# EasyEDA Pro project 包裹款-触摸屏控制板V1.eprj, schematic 原理图
Board Name: ESP32s3; Create Date: 2025-05-14; Page Name: 电源; Project Name: 包裹款-触摸屏控制板V1.0; Schematic Name: 原理图; Update Date: 2026-03-25; Company: 嘉立创EDA; Page Size: A3; Version: V1.0
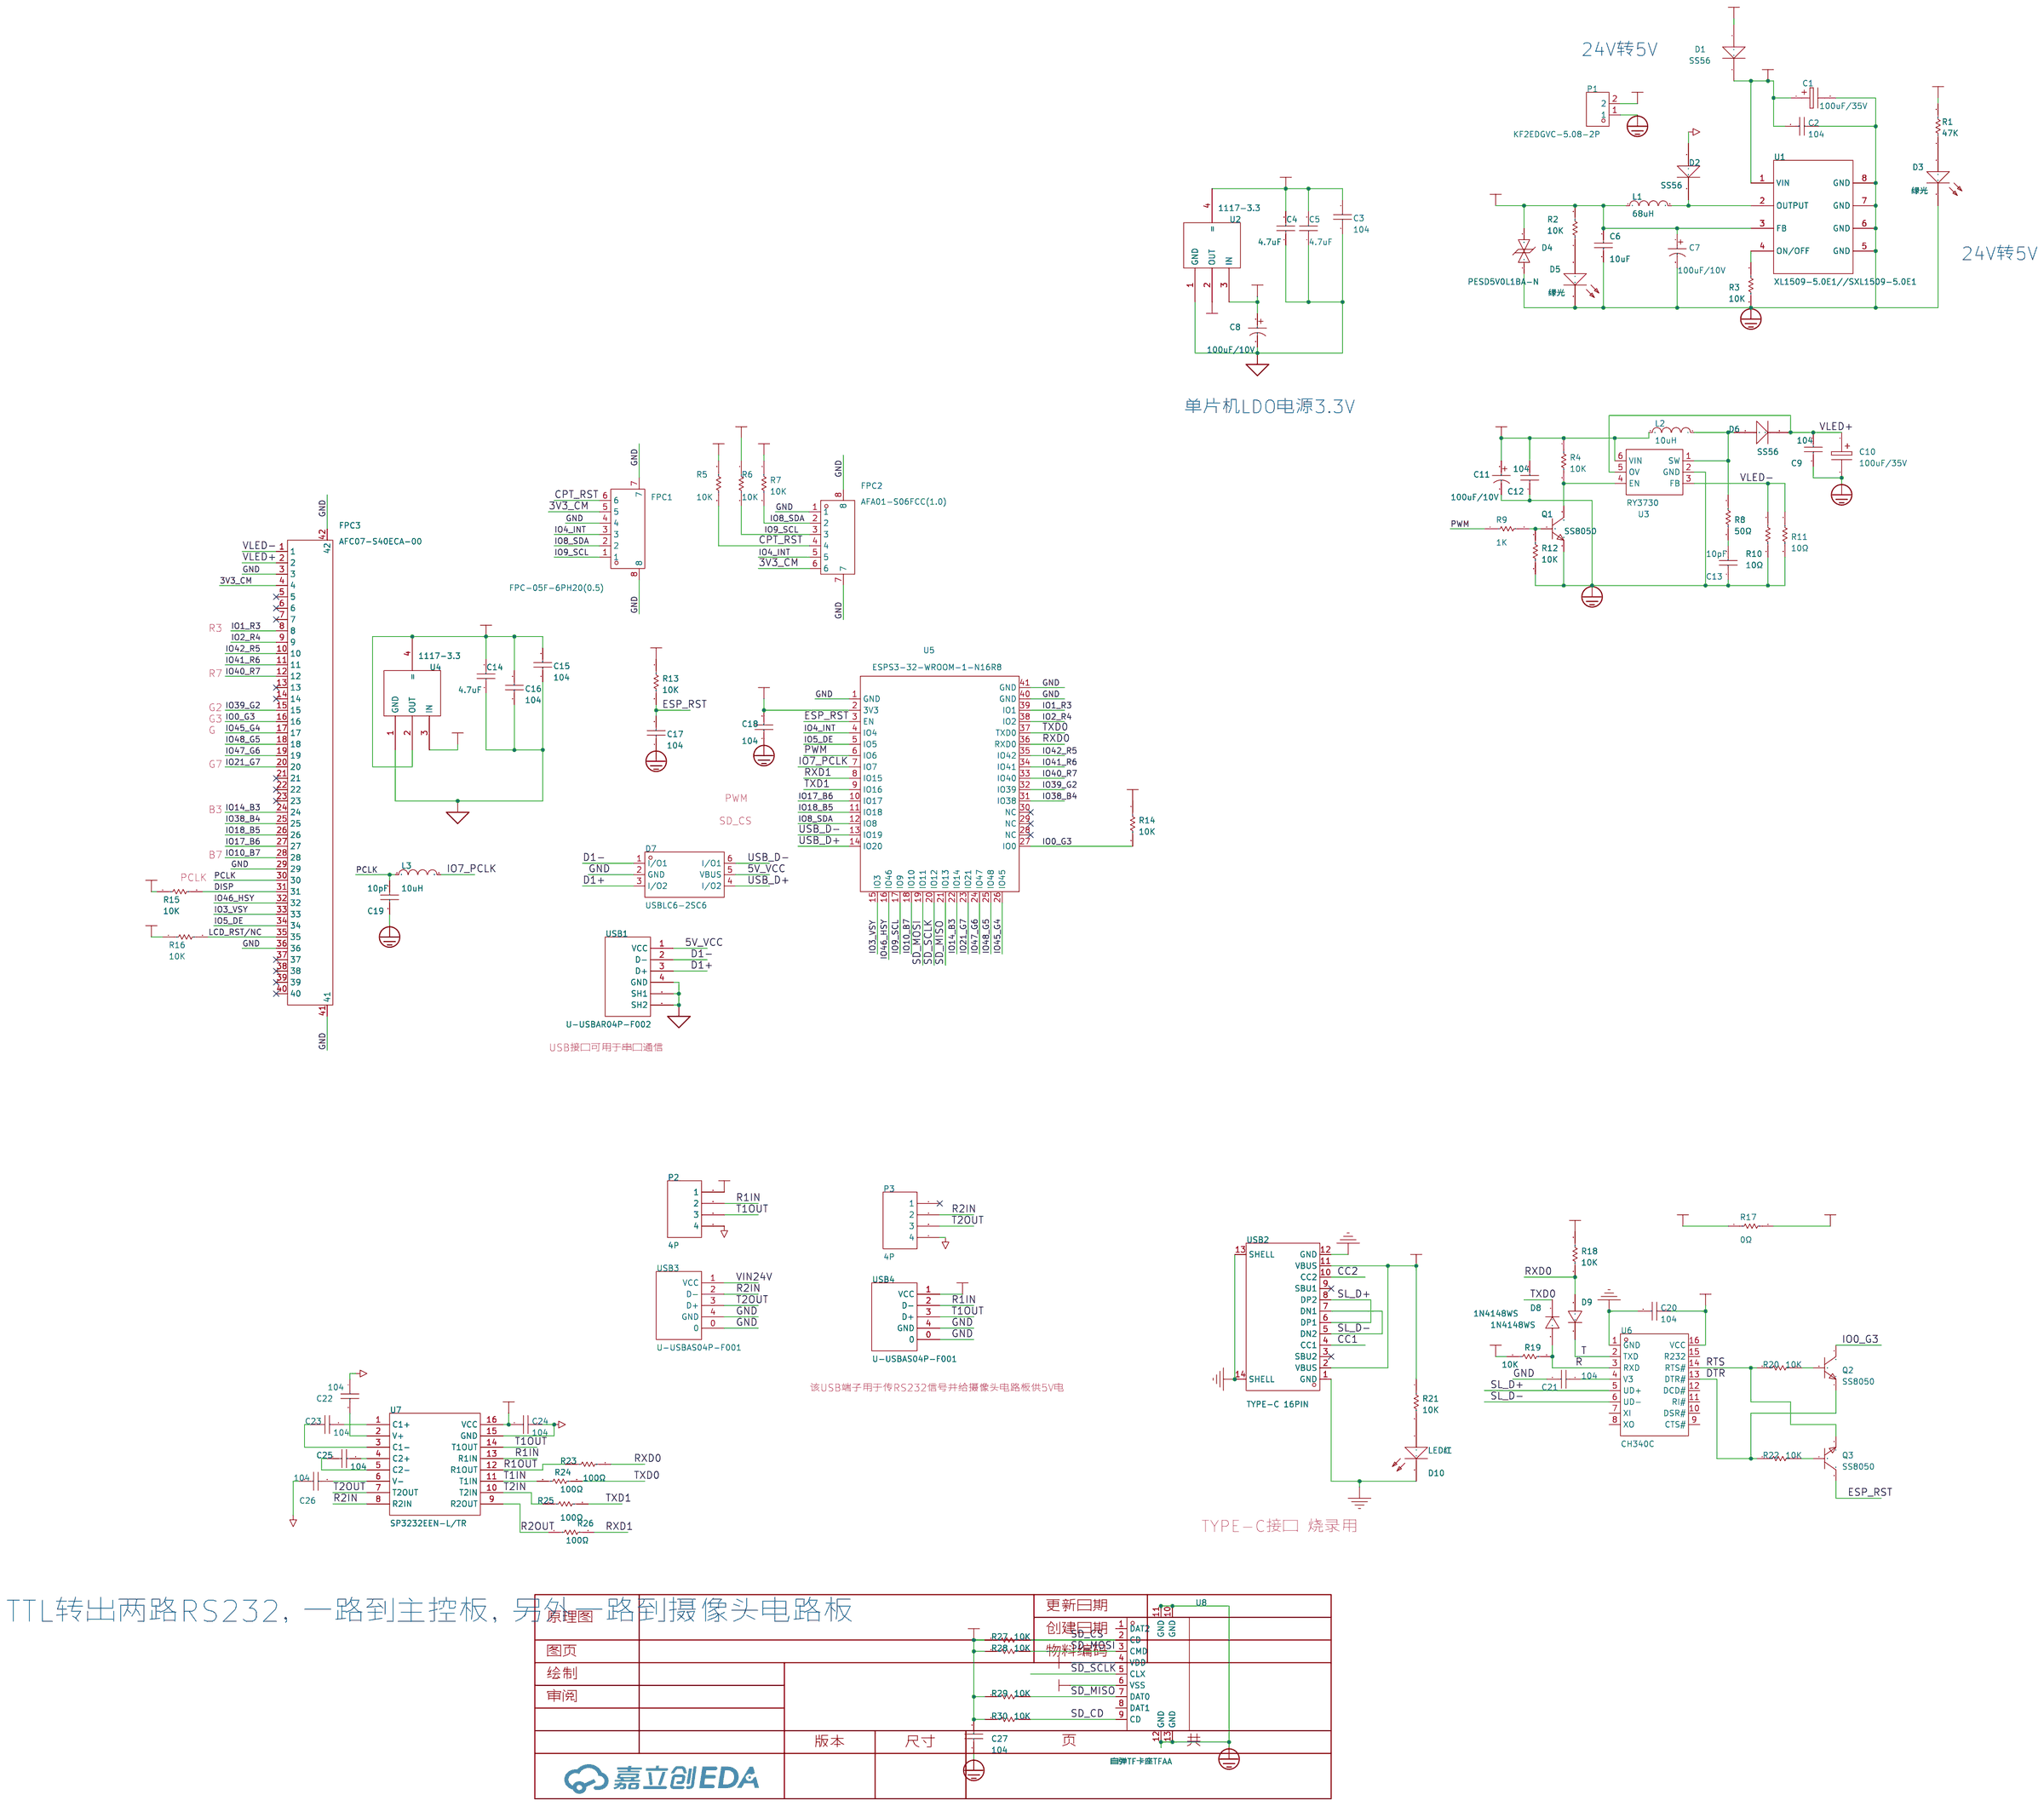
[diagram p0: schematic sheet]

## Parts
C1  100uF/35V  [电解电容贴片6X6]
C2  104  [0603C]
C3  104  [0603C]
C4  4.7uF  [C1206]
C5  4.7uF  [C1206]
C6  10uF  [C1206]
C7  100uF/10V  [CAP-SMD_BD5.0-L5.3-W5.3-RD]
C8  100uF/10V  [CAP-SMD_BD5.0-L5.3-W5.3-RD]
C9  104  [0603C]
C10  100uF/35V  [电解电容贴片6X6]
C11  100uF/10V  [CAP-SMD_BD5.0-L5.3-W5.3-RD]
C12  104  [0603C]
C13  10pF  [0603C]
C14  4.7uF  [C1206]
C15  104  [0603C]
C16  104  [0603C]
C17  104  [0603C]
C18  104  [0603C]
C19  10pF  [0603C]
C20  104  [0603C]
C21  104  [0603C]
C22  104  [0603C]
C23  104  [0603C]
C24  104  [0603C]
C25  104  [0603C]
C26  104  [0603C]
C27  104  [0603C]
D1  SS56  [SMA]
D2  SS56  [SMA]
D3  绿光  [0603LED]
D4  PESD5V0L1BA-N  [SOD-323_L1.8-W1.3-LS2.5-BI]
D5  绿光  [0603LED]
D6  SS56  [SMA]
D7  USBLC6-2SC6  [SOT-23-6_L2.9-W1.6-P0.95-LS2.8-BL]
D8  1N4148WS  [SOD-323_L1.8-W1.3-LS2.5-RD]
D9  1N4148WS  [SOD-323_L1.8-W1.3-LS2.5-RD]
D10  LED红  [0603L]
FPC1  FPC-05F-6PH20(0.5)  [FPC-SMD_6P-P0.50_XUNPU_FPC-05F-6PH20]
FPC2  AFA01-S06FCC(1.0)  [FPC-SMD_6P-P1.00_AFA01-S06]
FPC3  AFC07-S40ECA-00  [FPC-SMD_P0.50-40P_LCS-SJ-H2.0]
L1  68uH  [IND-SMD_L7.0-W7.0_SMDRI74-330MT]
L2  10uH  [IND-SMD_L7.0-W7.0_SMDRI74-330MT]
L3  10uH  [L0603]
P1  KF2EDGVC-5.08-2P  [CONN-TH_P5.08_KF2EDGVC-5.08-2P]
P2  4P  [HDR1X4_CON]
P3  4P  [HDR1X4_CON]
Q1  SS8050  [SOT-23-3_L2.9-W1.3-P1.90-LS2.4-BR]
Q2  SS8050  [SOT-23-3_L2.9-W1.3-P1.90-LS2.4-BR]
Q3  SS8050  [SOT-23-3_L2.9-W1.3-P1.90-LS2.4-BR]
R1  47K  [0603R]
R2  10K  [0603R]
R3  10K  [0603R]
R4  10K  [10]
R5  10K  [0603R]
R6  10K  [0603R]
R7  10K  [0603R]
R8  10K  [0603R]
R9  1K  [10]
R10  10K  [0603R]
R11  10K  [0603R]
R12  10K  [10]
R13  10K  [0603R]
R14  10K  [0603R]
R15  10K  [0603R]
R16  10K  [0603R]
R17  0Ω  [10]
R18  10K  [0603R]
R19  10K  [0603R]
R20  10K  [10]
R21  10K  [10]
R22  10K  [10]
R23  100Ω  [0603R]
R24  100Ω  [0603R]
R25  100Ω  [0603R]
R26  100Ω  [0603R]
R27  10K  [10]
R28  10K  [10]
R29  10K  [10]
R30  10K  [10]
U1  XL1509-5.0E1//SXL1509-5.0E1  [ESOP-8_L4.9-W3.9-P1.27-LS6.0-BL-EP]
U2  1117-3.3  [SOT-223]
U3  RY3730  [SOT-23-6_L2.9-W1.6-P0.95-LS2.8-BL_3]
U4  1117-3.3  [SOT-223]
U5  ESPS3-32-WROOM-1-N16R8  [WIRELM-SMD_ESP32-S3-WROOM-2-N32R8V]
U6  CH340C  [SOIC-16_L9.9-W3.9-P1.27-LS6.0-BL]
U7  SP3232EEN-L/TR  [SOIC-16_L9.9-W3.9-P1.27-LS6.0-BL]
U8  自弹TF卡座TFAA  [SIM-SMD_C9900015645]
USB1  U-USBAR04P-F002  [USB-A-TH_USB-302-T]
USB2  TYPE-C 16PIN  [USB-C-SMD_TYPE-C-6PIN+]
USB3  U-USBAS04P-F001  [USB-A-TH_USB-M-22]
USB4  U-USBAS04P-F001  [USB-A-TH_USB-M-22]

## Library data of the parts
C1 C10 = 100uF/35V: Origin Footprint 2: X47U; Origin Footprint 1: 电解电容贴片6x6; Design Item ID: ELECTRO1; Library Name: *
C2 C3 C9 C12 C13 C15-C19 C27 = 104: Capacitor (Semiconductor SIM Model); Published: 8-Jun-2000; LatestRevisionDate: 17-Jul-2002; LatestRevisionNote: Re-released for DXP Platform.; PackageReference: C1206; Publisher: Altium Limited; Origin Footprint 2: C1206; Origin Footprint 3: 0402; Origin Footprint 4: 1310[0504]; Origin Footprint 5: 1608[0603]; Origin Footprint 6: C1210; Origin Footprint 7: C0805; Origin Footprint 8: C1206; Origin Footprint 9: 0805; Origin Footprint 10: 0805L; Design Item ID: Cap Semi; Library Name: Miscellaneous Devices
C4-C6 C14 = 104: Design Item ID: CAP; Library Name: SCH--װ--
C7 C8 C11 = CS1A101M-CRD54: 容值:100uF;精度:±20%;额定电压:10V;电容体直径:5mm;电容体长度:5.4mm;纹波电流:-;等效串联电阻:-;工作寿命:1000hrs@105℃;工作温度:-40℃~+105℃;; LCSC Part Name: 100uF ±20% 10V; Supplier Part: C96182; Manufacturer: ST(先科); Supplier Footprint: SMD,5x5.4mm; JLCPCB Part Class: Extended Part; Datasheet: https://atta.szlcsc.com/upload/public/pdf/source/20170304/1488621207726.pdf; Supplier: LCSC; Tolerance: ±20%; Rated Voltage: 10V; φD: 5mm; L: 5.4mm; Lifetime @ Temp: 1000hrs@105℃; Operating Temperature: -40℃~+105℃
C20 C22-C26 = 103: Capacitor (Semiconductor SIM Model); Published: 8-Jun-2000; LatestRevisionDate: 17-Jul-2002; LatestRevisionNote: Re-released for DXP Platform.; PackageReference: C1206; Publisher: Altium Limited; Origin Footprint 2: C1206; Origin Footprint 3: 0402; Origin Footprint 4: 1310[0504]; Origin Footprint 5: 1608[0603]; Origin Footprint 6: C1210; Origin Footprint 7: C0805; Origin Footprint 8: C1206; Origin Footprint 9: 0805; Origin Footprint 10: 0805L; Design Item ID: Cap Semi; Library Name: Miscellaneous Devices
C21 = 104: Capacitor (Semiconductor SIM Model); Published: 8-Jun-2000; LatestRevisionDate: 17-Jul-2002; LatestRevisionNote: Re-released for DXP Platform.; PackageReference: C1206; Publisher: Altium Limited; Origin Footprint 2: C1206; Origin Footprint 3: 0402; Origin Footprint 4: 1310[0504]; Origin Footprint 5: 1608[0603]; Origin Footprint 6: C1210; Origin Footprint 7: C0805; Origin Footprint 8: C1206; Origin Footprint 9: 0805; Origin Footprint 10: 0805L; Origin Footprint 11: 0805C; Design Item ID: Cap Semi; Library Name: Miscellaneous Devices
D1 = SS56: Design Item ID: 1N4148; Library Name: SCH封装库
D2 D6 = SS56: Design Item ID: 1N4148; Library Name: SCH--װ--
D3 D5 = 绿光: Origin Footprint 2: LED(小); Design Item ID: LED; Library Name: SCH封装库
D4 = PESD5V0S1BBN: 极性:Bidirectional;反向关断电压（典型值）:5V (Max);击穿电压（最小值）:6V;箝位电压:15V;峰值脉冲电流（10/1000us）:5A (8/20us);; Supplier Part: C314264; Manufacturer: BORN伯恩半导体; Supplier Footprint: SOD-523; JLCPCB Part Class: Extended Part; Datasheet: https://atta.szlcsc.com/upload/public/pdf/source/20181015/C314264_F9AC5761AC2631DA841FBD1D9C6821E3.pdf; Supplier: LCSC; Polarity: Bidirectional; Voltage - Reverse Standoff (Typ): 5V (Max); Voltage - Breakdown (Min): 6V; Voltage - Clamping (Max) @ Ipp: 15V; Current - Peak Pulse (10/1000μs): 5A (8/20us)
D7 = USBLC6-2SC6: 最大钳位电压:15V;击穿电压:6V;; Supplier Part: C2687116; Manufacturer: UMW(友台半导体); Supplier Footprint: SOT-23-6; JLCPCB Part Class: 扩展库; Datasheet: https://atta.szlcsc.com/upload/public/pdf/source/20231109/512642D850D9873E7C519F71E85B9A10.pdf; Supplier: LCSC; Maximum Clamping Voltage: 15V; Breakdown Voltage: 6V; Number of Lines: 双路; Type: ESD
D8 D9 = 1N4148WS_C2128: 二极管配置:独立式;正向压降(Vf):1.25V@150mA;直流反向耐压(Vr):100V;整流电流:150mA;反向恢复时间(Trr):4ns;; LCSC Part Name: 丝印T4 1N4148WS; Supplier Part: C2128; Manufacturer: CJ(江苏长电/长晶); Supplier Footprint: SOD-323; JLCPCB Part Class: 基础库; Datasheet: https://item.szlcsc.com/datasheet/1N4148WS/2485.html; Supplier: LCSC; Diode Configuration: 独立式; Voltage - Forward(Vf@If): 1.25V@150mA; Voltage - DC Reverse(Vr): 100V; Current - Rectified: 150mA; Pd - Power Dissipation: 200mW; Reverse Leakage Current (Ir): 1uA@75V; Reverse Recovery Time (trr): 4ns; Non-Repetitive Peak Forward Surge Current: 2A
D10 = LED3: Typical BLUE SiC LED; Published: 8-Jun-2000; LatestRevisionDate: 17-Dec-2003; LatestRevisionNote: PCB Footprint replaced.; DatasheetVersion: 16-Apr-2002; PackageVersion: 16-Apr-2002; PackageReference: 3.5X2.8X1.9; Publisher: Altium Limited; PackageDescription: SM LED; 2 C-Bend Leads; Body 3.5 x 2.8 x 1.9 mm, inc leads (LxWxH typ); Origin Footprint 2: 3.5X2.8X1.9; Library Name: Miscellaneous Devices; Check: true
FPC1 = FPC-05F-6PH20: LCSC Part Name: 翻盖式 卧贴 P数:6P 间距:0.5mm; Supplier Part: C2856796; Manufacturer: XUNPU(讯普); Supplier Footprint: SMD,P=0.5mm,卧贴; JLCPCB Part Class: 扩展库; Datasheet: https://item.szlcsc.com/datasheet/FPC-05F-6PH20/3056894.html; Supplier: LCSC; Locking Feature: 翻盖式; Contact Type: 卧贴; Number of Contacts: 6P; Pitch: 0.5mm; Mounting Type: 下接; FFC, FCB Thickness: 0.3mm; Height Above Board: 2mm; Contact Material: 磷青铜; Contact Plating: 锡; Operating Temperature: -25℃~+85℃; Rated Voltage (Max): 50V; Current Rating (Max): 500mA
FPC2 = AFA01-S06FCC-00: LCSC Part Name: 翻盖式 下接 P数:6P 间距:1mm; Supplier Part: C262383; Manufacturer: JS(钜硕电子); Supplier Footprint: SMD,P=1mm,卧贴; JLCPCB Part Class: 扩展库; Datasheet: https://item.szlcsc.com/datasheet/AFA01-S06FCC-00/253767.html; Supplier: LCSC; Locking Feature: 翻盖式; Contact Type: 下接; Number of Contacts: 6P; Pitch: 1mm; Mounting Type: 卧贴; FFC, FCB Thickness: 0.3mm; Height Above Board: 2mm; Contact Material: 磷青铜; Operating Temperature: -45℃~+85℃; Rated Voltage (Max): 50V; Current Rating (Max): 500mA
FPC3 = AFC07-S40ECA-00: LCSC Part Name: 间距:0.5mm P数:40P 抽屉式 上接; Supplier Part: C262648; Manufacturer: JS(钜硕电子); Supplier Footprint: SMD,P=0.5mm,卧贴; JLCPCB Part Class: 扩展库; Datasheet: https://item.szlcsc.com/datasheet/AFC07-S40ECA-00/253907.html; Supplier: LCSC; Locking Feature: 抽屉式; Contact Type: 上接; Number of Contacts: 40P; Pitch: 0.5mm; Mounting Type: 卧贴; FFC, FCB Thickness: 0.3mm; Height Above Board: 2mm
L1 L2 = SMDRI74-330MT: 电感值:33uH;精度:±20%;额定电流:960mA;饱和电流(Isat):1.8A;类型:屏蔽电感;; LCSC Part Name: 33uH±20%1.8A; Supplier Part: C49625; Manufacturer: SXN(顺翔诺); Supplier Footprint: SMD,7.5x7.5mm; JLCPCB Part Class: 扩展库; Datasheet: https://atta.szlcsc.com/upload/public/pdf/source/20210810/6F96FDC19AA308DD2AD166FFB9640E87.pdf; Supplier: LCSC; Tolerance: ±20%; Rated Current: 960mA; Saturation Current (Isat): 1.8A; DC Resistance (DCR): 170mΩ; Type: 屏蔽电感
L3 = SDFL1608S100KTF: LCSC Part Name: 10uH ±10%; Supplier Part: C1035; Manufacturer: Sunlord(顺络); Supplier Footprint: 0603; JLCPCB Part Class: 基础库; Datasheet: https://item.szlcsc.com/datasheet/SDFL1608S100KTF/1387.html; Supplier: LCSC; Tolerance: ±10%; Current Rating: 3mA; DC Resistance(DCR): 1.85Ω; Q @ Frequency: 30@2MHz; Frequency - Self Resonant: 17MHz
P1 = KF2EDGVC-5.08-2P: LCSC Part Name: 5.08mm 1x2P 排数:1 每排P数:2; Supplier Part: C441386; Manufacturer: KEFA(科发); Supplier Footprint: 插件,P=5.08mm; JLCPCB Part Class: 扩展库; Datasheet: https://item.szlcsc.com/datasheet/KF2EDGVC-5.08-2P/441359.html; Supplier: LCSC; Connector Type: 板端/插座-闭口; Number of Positions or Pins: 1x2P; Pitch: 5.08mm; Color: 绿色; Mounting Type: 直针; Number of Pins: 2P; Number of Rows: 1; Number of PINs Per Row: 2; Current Rating: 15A; Voltage Rating (Max): 300V; Operating Temperature: -40℃~+105℃
P2 P3 = 4P: Library Name: SCH封装库
Q1-Q3 = SS8050: LCSC Part Name: NPN 25V 1.5A 120-400 SOT-23; Supplier Part: C2931717; Manufacturer: Doeshare(德芯); Supplier Footprint: SOT-23; JLCPCB Part Class: 扩展库; Datasheet: https://atta.szlcsc.com/upload/public/pdf/source/20220106/99F9A3DFCBDD91265C711555CE6390BF.pdf; Supplier: LCSC
R1 = 1K: Resistor; Published: 8-Jun-2000; LatestRevisionDate: 17-Jul-2002; LatestRevisionNote: Re-released for DXP Platform.; PackageReference: AXIAL-0.3; Publisher: Altium Limited; Origin Footprint 2: AXIAL-0.3; Origin Footprint 3: R0805; Origin Footprint 4: 0805R; Design Item ID: RES; Library Name: SCH封装库
R2 R5-R7 R13-R16 R18 R19 = 10K: Resistor; Published: 8-Jun-2000; LatestRevisionDate: 17-Jul-2002; LatestRevisionNote: Re-released for DXP Platform.; PackageReference: AXIAL-0.3; Publisher: Altium Limited; Origin Footprint 2: AXIAL-0.3; Origin Footprint 3: R0805; Origin Footprint 4: 0805R; Design Item ID: RES; Library Name: SCH封装库
R3 R8 R10 R11 = 10k: Resistor; Published: 8-Jun-2000; LatestRevisionDate: 17-Jul-2002; LatestRevisionNote: Re-released for DXP Platform.; PackageReference: AXIAL-0.3; Publisher: Altium Limited; Origin Footprint 2: AXIAL-0.3; Origin Footprint 3: R0805; Origin Footprint 4: 0805R; Design Item ID: RES; Library Name: SCH封装库
R4 R9 R12 R17 R20-R22 R27-R30 = 10K: Resistor; Published: 8-Jun-2000; LatestRevisionDate: 17-Jul-2002; LatestRevisionNote: Re-released for DXP Platform.; PackageReference: AXIAL-0.3; Publisher: Altium Limited; Origin Footprint 2: AXIAL-0.3; Origin Footprint 3: R0805; Origin Footprint 4: 0805R; Origin Footprint 1: 0603R; Design Item ID: RES; Library Name: SCH封装库
R23-R26 = 100: Resistor; Published: 8-Jun-2000; LatestRevisionDate: 17-Jul-2002; LatestRevisionNote: Re-released for DXP Platform.; PackageReference: AXIAL-0.3; Publisher: Altium Limited; Origin Footprint 2: AXIAL-0.3; Origin Footprint 3: R0805; Origin Footprint 4: 0805R; Design Item ID: RES; Library Name: SCH封装库
U1 = XL1509-5.0E1: 功能类型:降压型;同步整流:-;输出通道数:-;拓扑结构:-;输入电压:-;输出电流(最大值):-;开关频率:-;; LCSC Part Name: 降压型; Supplier Part: C61063; Manufacturer: XLSEMI(芯龙); Supplier Footprint: SOP-8_150mil; JLCPCB Part Class: Basic Part; Datasheet: https://atta.szlcsc.com/upload/public/pdf/source/20151020/1457707483545.pdf; Supplier: LCSC; Function: 降压型
U2 U4 = 1117-3.3: Design Item ID: LM1117; Library Name: Party600
U3 = MSAP3032KTR-G1: LCSC Part Name: 升压转换器驱动7串白光LED; Supplier Part: C49208388; Manufacturer: MSKSEMI(美森科); Supplier Footprint: SOT-23-6; JLCPCB Part Class: 扩展库; Datasheet: https://item.szlcsc.com/datasheet/MSAP3032KTR-G1/51614565.html; Supplier: LCSC; Voltage - Input(DC): 3V~24V; Frequency - Switching: 1.2MHz; Number of Channels: 1; Output Current: 20mA; Dimming: PWM; Features: 过温保护(OTP)；过压保护(OVP)；欠压保护(UVP); Topology: 升压; Operating temperature: -40℃~+85℃; Switch Tube (Built-In/External): 内置
U5 = ESP32-S3-WROOM-2-N32R8V: Supplier Part: C3021270; Manufacturer: ESPRESSIF(乐鑫); Supplier Footprint: SMD-41P; JLCPCB Part Class: 扩展库; Datasheet: https://atta.szlcsc.com/upload/public/pdf/source/20240130/C1D348304CAAF72A05B43D2BF874139A.pdf; Supplier: LCSC; Core Processor: ESP32-S3R8V芯片; Support Interface: I2C；GPIO；SPI；PWM；ADC；UART；USB；I2S; Output Power: 20.5dBm
U6 = CH340G: 应用功能:收发器;接口协议:USB 2.0;数据速率:2Mbps;; LCSC Part Name: USB转串口芯片 CH340; Supplier Part: C14267; Manufacturer: WCH(南京沁恒); Supplier Footprint: SOP-16; JLCPCB Part Class: 扩展库; Datasheet: https://atta.szlcsc.com/upload/public/pdf/source/20230530/6E401E9554E9F5311886CC8B3F89B62E.pdf; Supplier: LCSC; Applications Function: 收发器; Protocol: USB 2.0; Supply Voltage: 3.3V；5V; Data Rate: 2Mbps
U7 = SP3232EEN-L/TR: LCSC Part Name: True3.0V至5.5V RS-232收发器; Supplier Part: C9378; Manufacturer: MaxLinear(迈凌); Supplier Footprint: SOIC-16; JLCPCB Part Class: 扩展库; Datasheet: https://item.szlcsc.com/datasheet/SP3232EEN-L%252FTR/9907.html; Supplier: LCSC; Type: 收发器; Number of Drivers: 2; Number of Receivers: 2; Data Rate: 235Kbps; Voltage - Supply: 3V~5.5V; Operating Temperature: -40℃~+85℃
U8 = 自弹TF卡座TFAA: Supplier Part: C9900015645; Supplier Footprint: SMD; JLCPCB Part Class: 扩展库; Supplier: LCSC
USB1 = U-USBAR04P-F002: 连接器类型:Type-A;协议标准:USB 2.0;公母:母;安装方式:弯插;触点数量:4P;端口数量:1;额定电流 - 电源:1.5A;工作温度:0℃~+50℃;; LCSC Part Name: USB母座; Supplier Part: C386736; Manufacturer: Ckmtw(灿科盟); Supplier Footprint: 弯插; JLCPCB Part Class: 扩展库; Datasheet: https://item.szlcsc.com/datasheet/U-USBAR04P-F002/360843.html; Supplier: LCSC; Connector Type: Type-A; Protocol Standard: USB 2.0; Gender: 母; Mounting Type: 弯插; Number of Contacts: 4P; Number of Ports: 1; Current Rating-Power: 1.5A; Voltage Rating: 30V; Length: 14mm; Detection color: 白色; Operating Temperature: 0℃~+50℃
USB2 = TYPE-C 16PIN 2MD(073): 连接器类型:Type-C;标准:-;公母:母;端口数量:1;触点数量:16P;安装方式:卧贴;额定电流 - 电源:5A;工作温度范围:-25℃~+85℃;; LCSC Part Name: Type-C 母 卧贴; Supplier Part: C2765186; Manufacturer: SHOU HAN(首韩); Supplier Footprint: SMD; JLCPCB Part Class: Extended Part; Datasheet: https://atta.szlcsc.com/upload/public/pdf/source/20211123/39B17C16241EAC15C5E277BDA434118E.pdf; Supplier: LCSC; Connector Type: Type-C; Gender: 母; Number of Ports: 1; Number of Contacts: 16P; Mounting Style: 卧贴; Current Rating - Power (Max): 5A; Operating Temperature Range: -25℃~+85℃
USB3 USB4 = U-USBAS04P-F001: 连接器类型:Type-A;协议标准:USB 2.0;公母:母;安装方式:直插;触点数量:4P;端口数量:1;额定电流 - 电源:1.5A;工作温度:0℃~+50℃;; LCSC Part Name: Type-A 母 直插; Supplier Part: C386737; Manufacturer: Ckmtw(灿科盟); Supplier Footprint: 插件; JLCPCB Part Class: 扩展库; Datasheet: https://item.szlcsc.com/datasheet/U-USBAS04P-F001/360844.html; Supplier: LCSC; Connector Type: Type-A; Protocol Standard: USB 2.0; Gender: 母; Mounting Type: 直插; Number of Contacts: 4P; Number of Ports: 1; Current Rating-Power: 1.5A; Voltage Rating: 30V; Connect-Disconnect Life: 1.5千次; Length: 15mm; Operating Temperature: 0℃~+50℃

## Nets
3V3: C3.2 C4.2 C5.2 C18.2 C27.1 R13.1 R14.1 R18.2 R27.2 R28.2 R29.2 R30.2 U2.2(OUT) U2.4(=) U5.2(3V3) U8.4(VDD)
3V3_CM: C14.2 C15.2 C16.2 FPC1.5 FPC2.6 FPC3.4 R5.1 R6.1 R7.1 R15.1 R16.1 U4.2(OUT) U4.4(=)
5V_SHAOLU: R17.1 R21.1 USB2.2(VBUS) USB2.11(VBUS)
5V_VCC: C6.1 C7.1 C8.1 C11.1 C12.2 C20.1 C24.2 D4.2 D7.5(VBUS) L1.1 L2.1 P2.1 R2.2 R4.1 R17.2 R19.1 U1.3(FB) U2.3(IN) U3.6(VIN) U4.3(IN) U6.16(VCC) U7.16(VCC) USB1.1(VCC) USB4.1(VCC)
24V_D1: C1.1 C2.2 D1.2 R1.2 U1.1(VIN)
GND: C1.2 C2.1 C3.1 C4.1 C5.1 C6.2 C7.2 C8.2 C9.1 C10.2 C11.2 C12.1 C13.1 C14.1 C15.1 C16.1 C17.1 C18.1 C19.1 C20.2 C21.2 C22.1 C24.1 C26.2 C27.2 D2.1 D3.2 D4.1 D5.2 D7.2(GND) D10.2(K) FPC1.4 FPC1.7 FPC1.8 FPC2.1 FPC2.7 FPC2.8 FPC3.3 FPC3.29 FPC3.36 FPC3.41 FPC3.42 P1.1 P2.4 P3.4 Q1.2(E) R3.2 R10.2 R11.2 R12.2 U1.5(GND) U1.6(GND) U1.7(GND) U1.8(GND) U2.1(GND) U3.2(GND) U4.1(GND) U5.1(GND) U5.40(GND) U5.41(GND) U6.1(GND) U7.15(GND) U8.6(VSS) U8.10(GND) U8.11(GND) U8.12(GND) U8.13(GND) USB1.4(GND) USB1.5(SH1) USB1.6(SH2) USB2.1(GND) USB2.12(GND) USB2.13(SHELL) USB2.14(SHELL) USB3.0 USB3.4(GND) USB4.0 USB4.4(GND)
VIN24V: D1.1 P1.2 USB3.1(VCC)
CC1: USB2.4(CC1)
CC2: USB2.10(CC2)
CPT_RST: FPC1.6 FPC2.4 R5.2
D1+: D7.3(I/O2) USB1.3(D+)
D1-: D7.1(I/O1) USB1.2(D-)
DISP: FPC3.31 R15.2
DTR: Q2.2(E) R22.2 U6.13(DTR#)
ESP_RST: C17.2 Q3.3(C) R13.2 U5.3(EN)
IO0_G3: FPC3.16 Q2.3(C) R14.2 U5.27(IO0)
IO1_R3: FPC3.8 U5.39(IO1)
IO2_R4: FPC3.9 U5.38(IO2)
IO3_VSY: FPC3.33 U5.15(IO3)
IO4_INT: FPC1.3 FPC2.5 U5.4(IO4)
IO5_DE: FPC3.34 U5.5(IO5)
IO7_PCLK: L3.2 U5.7(IO7)
IO8_SDA: FPC1.2 FPC2.2 R7.2 U5.12(IO8)
IO9_SCL: FPC1.1 FPC2.3 R6.2 U5.17(IO9)
IO10_B7: FPC3.28 U5.18(IO10)
IO14_B3: FPC3.24 U5.22(IO14)
IO17_B6: FPC3.27 U5.10(IO17)
IO18_B5: FPC3.26 U5.11(IO18)
IO21_G7: FPC3.20 U5.23(IO21)
IO38_B4: FPC3.25 U5.31(IO38)
IO39_G2: FPC3.15 U5.32(IO39)
IO40_R7: FPC3.12 U5.33(IO40)
IO41_R6: FPC3.11 U5.34(IO41)
IO42_R5: FPC3.10 U5.35(IO42)
IO45_G4: FPC3.17 U5.26(IO45)
IO46_HSY: FPC3.32 U5.16(IO46)
IO47_G6: FPC3.19 U5.24(IO47)
IO48_G5: FPC3.18 U5.25(IO48)
LCD_RST/NC: FPC3.35 R16.2
PCLK: C19.2 FPC3.30 L3.1
PWM: R9.1 U5.6(IO6)
R: D8.2(A) R19.2 U6.3(RXD)
R1IN: P2.2 U7.13(R1IN) USB4.2(D-)
R1OUT: R23.1 U7.12(R1OUT)
R2IN: P3.2 U7.8(R2IN) USB3.2(D-)
R2OUT: R26.1 U7.9(R2OUT)
RTS: Q3.2(E) R20.2 U6.14(RTS#)
RXD0: D9.2(A) R18.1 R23.2 U5.36(RXD0)
RXD1: R26.2 U5.8(IO15)
SD_CD: R30.1 U8.9(CD)
SD_CS: R27.1 U8.2(CD)
SD_MISO: R29.1 U5.21(IO13) U8.7(DAT0)
SD_MOSI: R28.1 U5.19(IO11) U8.3(CMD)
SD_SCLK: U5.20(IO12) U8.5(CLX)
SL_D+: U6.5(UD+) USB2.6(DP1) USB2.8(DP2)
SL_D-: U6.6(UD-) USB2.5(DN2) USB2.7(DN1)
T: D9.1(K) U6.2(TXD)
T1IN: R24.1 U7.11(T1IN)
T1OUT: P2.3 U7.14(T1OUT) USB4.3(D+)
T2IN: R25.1 U7.10(T2IN)
T2OUT: P3.3 U7.7(T2OUT) USB3.3(D+)
TXD0: D8.1(K) R24.2 U5.37(TXD0)
TXD1: R25.2 U5.9(IO16)
USB_D+: D7.4(I/O2) U5.14(IO20)
USB_D-: D7.6(I/O1) U5.13(IO19)
VLED+: C9.2 C10.1 D6.2 FPC3.2 U3.5(OV)
VLED-: FPC3.1 R10.1 R11.1 U3.3(FB)
$9N274640: D2.2 L1.2 U1.2(OUTPUT)
$9N274642: R3.1 U1.4(ON/OFF)
$9N274647: D3.1 R1.1
$9N274649: D5.1 R2.1
$9N275850: C21.1 U6.4(V3)
$9N275879: Q2.1(B) R20.1
$9N275880: Q3.1(B) R22.1
$9N276006: D10.1(A) R21.2
$9N276822: C26.1 U7.6(V-)
$9N276825: C22.2 U7.2(V+)
$9N276826: C25.2 U7.4(C2+)
$9N276827: C25.1 U7.5(C2-)
$9N276828: C23.2 U7.1(C1+)
$9N276829: C23.1 U7.3(C1-)
$9N279321: C13.2 R8.2
$9N279477: D6.1 L2.2 R8.1 U3.1(SW)
$9N279526: Q1.3(C) R4.2 U3.4(EN)
$9N279598: Q1.1(B) R9.2 R12.1

Not connected (* = marked no-connect by the designer): FPC3 5* 6* 7* 13* 14* 21* 22* 23* 37* 38* 39* 40*; P3 1*; U5 28(NC)* 29(NC)* 30(NC)*; U6 7(XI) 8(XO) 9(CTS#) 10(DSR#) 11(RI#) 12(DCD#) 15(R232); U8 1(DAT2) 8(DAT1); USB2 3(SBU2)* 9(SBU1)*

## Notes on the sheet
- 24V转5V
- 24V转5V
- 单片机LDO电源3.3V
- R3
- R7
- G2
- G3
- G
- G7
- PWM
- B3
- SD_CS
- B7
- PCLK
- USB接口可用于串口通信
- 该USB端子用于传RS232信号并给摄像头电路板供5V电
- TYPE-C接口 烧录用
- TTL转出两路RS232，一路到主控板，另外一路到摄像头电路板
